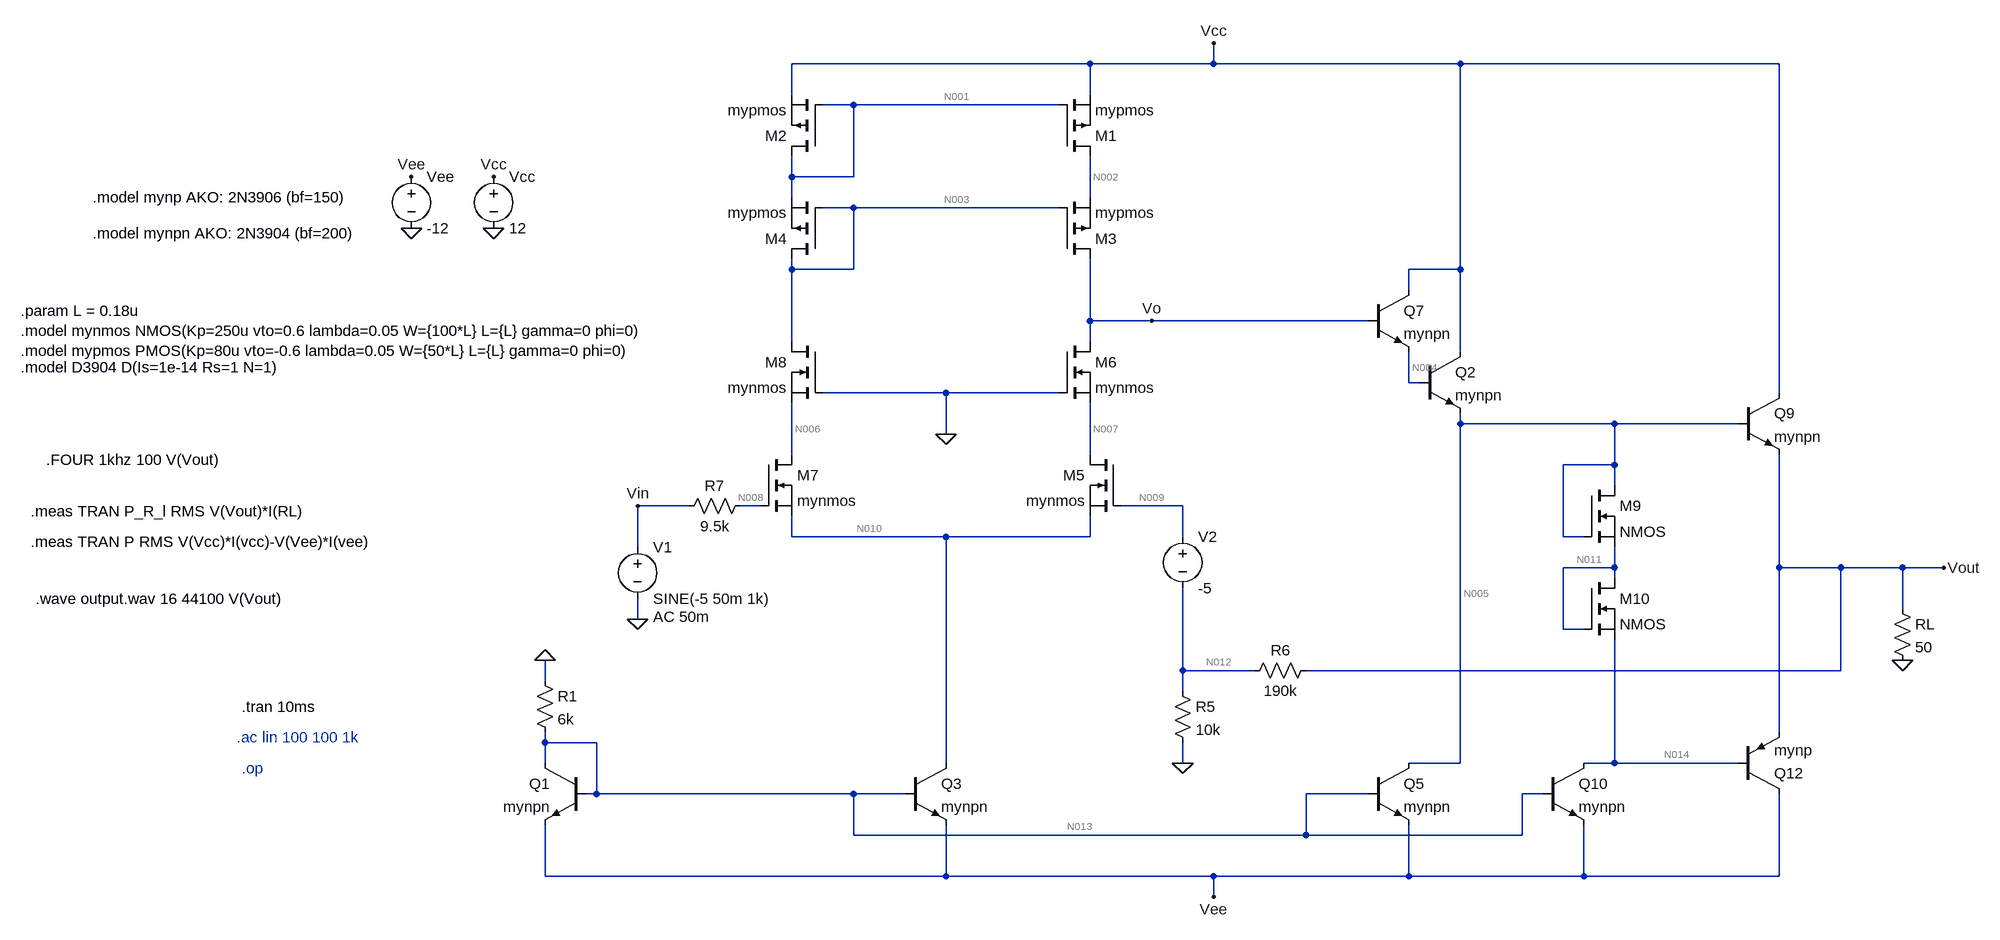
[diagram p0: schematic Ph2_403102322.asc]
Ph2_403102322.asc, the LTspice schematic file:
Version 4.1
SHEET 1 2356 872
WIRE 784 -640 320 -640
WIRE 976 -640 976 -672
WIRE 976 -640 784 -640
WIRE 1360 -640 976 -640
WIRE 1856 -640 1360 -640
WIRE 320 -592 320 -640
WIRE 784 -592 784 -640
WIRE 416 -576 368 -576
WIRE 736 -576 416 -576
WIRE 320 -464 320 -496
WIRE 416 -464 416 -576
WIRE 416 -464 320 -464
WIRE 320 -432 320 -464
WIRE 784 -432 784 -496
WIRE 416 -416 368 -416
WIRE 736 -416 416 -416
WIRE 320 -320 320 -336
WIRE 416 -320 416 -416
WIRE 416 -320 320 -320
WIRE 1360 -320 1360 -640
WIRE 1360 -320 1280 -320
WIRE 1280 -288 1280 -320
WIRE 784 -240 784 -336
WIRE 880 -240 784 -240
WIRE 1216 -240 880 -240
WIRE 320 -208 320 -320
WIRE 784 -208 784 -240
WIRE 1360 -192 1360 -320
WIRE 1280 -144 1280 -192
WIRE 1296 -144 1280 -144
WIRE 560 -128 368 -128
WIRE 736 -128 560 -128
WIRE 1856 -128 1856 -640
WIRE 1360 -80 1360 -96
WIRE 1600 -80 1360 -80
WIRE 1792 -80 1600 -80
WIRE 560 -64 560 -128
WIRE 320 -32 320 -112
WIRE 784 -32 784 -112
WIRE 1600 -16 1600 -80
WIRE 1600 -16 1520 -16
WIRE 1600 16 1600 -16
WIRE 160 48 80 48
WIRE 272 48 240 48
WIRE 928 48 832 48
WIRE 320 96 320 64
WIRE 560 96 320 96
WIRE 784 96 784 64
WIRE 784 96 560 96
WIRE 928 96 928 48
WIRE 1520 96 1520 -16
WIRE 1552 96 1520 96
WIRE 80 112 80 48
WIRE 1600 144 1600 112
WIRE 1600 144 1520 144
WIRE 1856 144 1856 -32
WIRE 1952 144 1856 144
WIRE 2048 144 1952 144
WIRE 2112 144 2048 144
WIRE 1600 160 1600 144
WIRE 2048 208 2048 144
WIRE 80 224 80 192
WIRE 1520 240 1520 144
WIRE 1552 240 1520 240
WIRE 928 304 928 176
WIRE 1040 304 928 304
WIRE 1952 304 1952 144
WIRE 1952 304 1120 304
WIRE -64 320 -64 288
WIRE 928 336 928 304
WIRE 1856 400 1856 144
WIRE -64 416 -64 400
WIRE 16 416 -64 416
WIRE -64 448 -64 416
WIRE 560 448 560 96
WIRE 928 448 928 416
WIRE 1360 448 1360 -80
WIRE 1360 448 1280 448
WIRE 1600 448 1600 256
WIRE 1600 448 1552 448
WIRE 1792 448 1600 448
WIRE 16 496 16 416
WIRE 16 496 0 496
WIRE 416 496 16 496
WIRE 496 496 416 496
WIRE 1216 496 1120 496
WIRE 1488 496 1456 496
WIRE 416 560 416 496
WIRE 1120 560 1120 496
WIRE 1120 560 416 560
WIRE 1456 560 1456 496
WIRE 1456 560 1120 560
WIRE -64 624 -64 544
WIRE 560 624 560 544
WIRE 560 624 -64 624
WIRE 976 624 560 624
WIRE 1280 624 1280 544
WIRE 1280 624 976 624
WIRE 1552 624 1552 544
WIRE 1552 624 1280 624
WIRE 1856 624 1856 496
WIRE 1856 624 1552 624
WIRE 976 656 976 624
FLAG -272 -384 0
FLAG -144 -384 0
FLAG -272 -464 Vee
FLAG -144 -464 Vcc
FLAG 80 224 0
FLAG 880 -240 Vo
FLAG 2048 288 0
FLAG 2112 144 Vout
FLAG 928 448 0
FLAG 560 -64 0
FLAG 80 48 Vin
FLAG -64 288 0
FLAG 976 -672 Vcc
FLAG 976 656 Vee
SYMBOL res -80 304 R0
SYMATTR InstName R1
SYMATTR Value 6k
SYMBOL npn 0 448 M0
SYMATTR InstName Q1
SYMATTR Value mynpn
SYMBOL npn 496 448 R0
SYMATTR InstName Q3
SYMATTR Value mynpn
SYMBOL voltage -272 -480 R0
SYMATTR InstName Vee
SYMATTR Value -12
SYMBOL voltage -144 -480 R0
WINDOW 123 0 0 Left 0
WINDOW 39 0 0 Left 0
SYMATTR InstName Vcc
SYMATTR Value 12
SYMBOL voltage 80 96 R0
WINDOW 123 24 124 Left 2
WINDOW 39 0 0 Left 0
SYMATTR Value2 AC 50m
SYMATTR InstName V1
SYMATTR Value SINE(-5 50m 1k)
SYMBOL npn 1216 448 R0
SYMATTR InstName Q5
SYMATTR Value mynpn
SYMBOL npn 1216 -288 R0
SYMATTR InstName Q7
SYMATTR Value mynpn
SYMBOL pmos 736 -496 M180
SYMATTR InstName M1
SYMATTR Value mypmos
SYMBOL pmos 368 -496 R180
SYMATTR InstName M2
SYMATTR Value mypmos
SYMBOL nmos 832 -32 M0
SYMATTR InstName M5
SYMATTR Value mynmos
SYMBOL nmos 272 -32 R0
SYMATTR InstName M7
SYMATTR Value mynmos
SYMBOL nmos 736 -208 R0
SYMATTR InstName M6
SYMATTR Value mynmos
SYMBOL nmos 368 -208 M0
SYMATTR InstName M8
SYMATTR Value mynmos
SYMBOL pmos 736 -336 M180
SYMATTR InstName M3
SYMATTR Value mypmos
SYMBOL pmos 368 -336 R180
SYMATTR InstName M4
SYMATTR Value mypmos
SYMBOL res 2032 192 R0
SYMATTR InstName RL
SYMATTR Value 50
SYMBOL npn 1488 448 R0
SYMATTR InstName Q10
SYMATTR Value mynpn
SYMBOL npn 1792 -128 R0
SYMATTR InstName Q9
SYMATTR Value mynpn
SYMBOL pnp 1792 496 M180
SYMATTR InstName Q12
SYMATTR Value mynp
SYMBOL res 912 320 R0
SYMATTR InstName R5
SYMATTR Value 10k
SYMBOL res 1136 288 R90
WINDOW 0 0 56 VBottom 2
WINDOW 3 32 56 VTop 2
SYMATTR InstName R6
SYMATTR Value 190k
SYMBOL res 256 32 R90
WINDOW 0 0 56 VBottom 2
WINDOW 3 32 56 VTop 2
SYMATTR InstName R7
SYMATTR Value 9.5k
SYMBOL voltage 928 80 R0
WINDOW 123 0 0 Left 0
WINDOW 39 0 0 Left 0
SYMATTR InstName V2
SYMATTR Value -5
SYMBOL npn 1296 -192 R0
SYMATTR InstName Q2
SYMATTR Value mynpn
SYMBOL nmos 1552 16 R0
SYMATTR InstName M9
SYMBOL nmos 1552 160 R0
SYMATTR InstName M10
TEXT -768 -432 Left 2 !.model mynp AKO: 2N3906 (bf=150)
TEXT -768 -376 Left 2 !.model mynpn AKO: 2N3904 (bf=200)
TEXT -880 -256 Left 2 !.param L = 0.18u\n.model mynmos NMOS(Kp=250u vto=0.6 lambda=0.05 W={100*L} L={L} gamma=0 phi=0)\n.model mypmos PMOS(Kp=80u vto=-0.6 lambda=0.05 W={50*L} L={L} gamma=0 phi=0)
TEXT -536 456 Left 2 ;.op
TEXT -544 408 Left 2 ;.ac lin 100 100 1k
TEXT -536 360 Left 2 !.tran 10ms
TEXT -880 -168 Left 2 !.model D3904 D(Is=1e-14 Rs=1 N=1)
TEXT -840 -24 Left 2 !.FOUR 1khz 100 V(Vout)
TEXT -864 56 Left 2 !.meas TRAN P_R_l RMS V(Vout)*I(RL)
TEXT -864 104 Left 2 !.meas TRAN P RMS V(Vcc)*I(vcc)-V(Vee)*I(vee)
TEXT -856 192 Left 2 !.wave output.wav 16 44100 V(Vout)

The netlist it stands for:
* Ph2_403102322.asc
R1 0 N013 6k
Q1 N013 N013 Vee 0 mynpn
Q3 N010 N013 Vee 0 mynpn
Vee Vee 0 -12
Vcc Vcc 0 12
V1 Vin 0 SINE(-5 50m 1k) AC 50m
Q5 N005 N013 Vee 0 mynpn
Q7 Vcc Vo N004 0 mynpn
M1 N002 N001 Vcc Vcc mypmos
M2 N001 N001 Vcc Vcc mypmos
M5 N007 N009 N010 N010 mynmos
M7 N006 N008 N010 N010 mynmos
M6 Vo 0 N007 N007 mynmos
M8 N003 0 N006 N006 mynmos
M3 Vo N003 N002 N002 mypmos
M4 N003 N003 N001 N001 mypmos
RL Vout 0 50
Q10 N014 N013 Vee 0 mynpn
Q9 Vcc N005 Vout 0 mynpn
Q12 Vee N014 Vout 0 mynp
R5 N012 0 10k
R6 Vout N012 190k
R7 N008 Vin 9.5k
V2 N009 N012 -5
Q2 Vcc N004 N005 0 mynpn
M9 N005 N005 N011 N011 NMOS
M10 N011 N011 N014 N014 NMOS
.model NPN NPN
.model PNP PNP
.lib standard.bjt
.model NMOS NMOS
.model PMOS PMOS
.lib standard.mos
.model mynp AKO: 2N3906 (bf=150)
.model mynpn AKO: 2N3904 (bf=200)
.param L = 0.18u
.model mynmos NMOS(Kp=250u vto=0.6 lambda=0.05 W={100*L} L={L} gamma=0 phi=0)
.model mypmos PMOS(Kp=80u vto=-0.6 lambda=0.05 W={50*L} L={L} gamma=0 phi=0)
* .op
* .ac lin 100 100 1k
.tran 10ms
.model D3904 D(Is=1e-14 Rs=1 N=1)
.FOUR 1khz 100 V(Vout)
.meas TRAN P_R_l RMS V(Vout)*I(RL)
.meas TRAN P RMS V(Vcc)*I(vcc)-V(Vee)*I(vee)
.wave output.wav 16 44100 V(Vout)
.backanno
.end

* Results of the author's LTspice run, read from the files saved beside the schematic
* Operating Point, zero values left out:
*   V(vee) = -12 V
*   V(vcc) = 12 V
*   V(vin) = -5 V
*   V(vo) = 2.103 V
*   V(n001) = 10.72 V
*   V(n009) = -4.999 V
*   V(n006) = -826.9 mV
*   V(n003) = 9.447 V
*   V(n012) = 694.6 µV
*   V(n013) = -11.33 V
*   V(n010) = -5.85 V
*   V(n005) = 870.6 mV
*   V(n004) = 1.557 V
*   V(n002) = 10.63 V
*   V(n007) = -861 mV
*   V(n008) = -5 V
*   V(vout) = 13.89 mV
*   V(n014) = -852.7 mV
*   V(n011) = 8.956 mV
*   I(Vcc) = -231.7 mA
*   Ic(Q7) = 16.36 µA
*   Ib(Q7) = 74.42 nA
*   Ie(Q7) = -16.43 µA
*   Id(M5) = 977.8 µA
*   Is(M5) = -977.8 µA
*   Ib(M5) = -4.999 pA
*   Id(M6) = 977.8 µA
*   Is(M6) = -977.8 µA
*   Ib(M6) = -2.974 pA
*   Id(M4) = -973.7 µA
*   Is(M4) = 973.7 µA
*   Ib(M4) = 1.287 pA
*   Ic(Q9) = 226.1 mA
*   Ib(Q9) = 1.534 mA
*   Ie(Q9) = -227.6 mA
*   I(R5) = 69.46 nA
*   I(R1) = 1.888 mA
*   Ic(Q3) = 1.952 mA
*   Ib(Q3) = 9.294 µA
*   Ie(Q3) = -1.961 mA
*   Id(M8) = 973.7 µA
*   Is(M8) = -973.7 µA
*   Ib(M8) = -10.28 pA
*   Id(M9) = 7.424 µA
*   Is(M9) = -7.424 µA
*   Id(M10) = 7.424 µA
*   Is(M10) = -7.424 µA
*   Ic(Q1) = 1.851 mA
*   Ib(Q1) = 9.297 µA
*   Ie(Q1) = -1.86 mA
*   Ic(Q5) = 2.075 mA
*   Ib(Q5) = 9.289 µA
*   Ie(Q5) = -2.084 mA
*   Id(M1) = -977.9 µA
*   Is(M1) = 977.9 µA
*   Ib(M1) = 1.378 pA
*   Id(M7) = 973.7 µA
*   Is(M7) = -973.7 µA
*   Ib(M7) = -5.033 pA
*   I(RL) = 277.8 µA
*   Ic(Q10) = 2.043 mA
*   Ib(Q10) = 9.29 µA
*   Ie(Q10) = -2.053 mA
*   Ic(Q12) = -225.3 mA
*   Ib(Q12) = -2.036 mA
*   Ie(Q12) = 227.3 mA
*   I(Vee) = 233.3 mA
*   Id(M2) = -973.7 µA
*   Is(M2) = 973.7 µA
*   Ib(M2) = 1.287 pA
*   Id(M3) = -977.9 µA
*   Is(M3) = 977.9 µA
*   Ib(M3) = 8.539 pA
*   I(R6) = 69.46 nA
*   Ic(Q2) = 3.6 mA
*   Ib(Q2) = 16.43 µA
*   Ie(Q2) = -3.617 mA
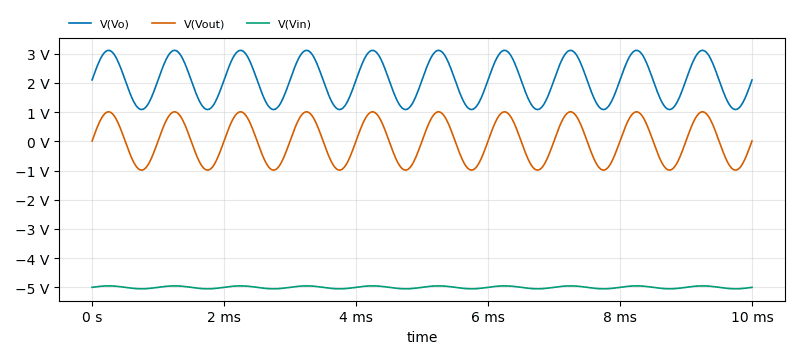
[diagram p1: Transient Analysis of Ph2_403102322.asc, plotted from the saved traces]
* Transient Analysis, 1 run:
*   V(Vo): min 1.09 V, max 3.117 V, average 2.103 V, rms 2.222 V, last 2.103 V
*   V(Vout): min -984.4 mV, max 1.012 V, average 13.89 mV, rms 706.2 mV, last 13.86 mV
*   V(Vin): min -5.05 V, max -4.95 V, average -5 V, rms 5 V, last -5 V
* From the log:
*   P_R_l: RMS(V(Vout)*I(RL))=0.0122060317851 FROM 0 TO 0.01
*   P: RMS(V(Vcc)*I(vcc)-V(Vee)*I(vee))=0.170489128881 FROM 0 TO 0.01
*   Fourier components of V(Vout)
*   N-Period=1
*   DC component:0.0138875
*   Harmonic  Frequency   Fourier   Normalized   Phase    Normalized
*    Number     [Hz]     Component   Component  [degree]  Phase [deg]
*       1      1.000e+03   9.979e-01   1.000e+00     90.00°      0.00°
*       2      2.000e+03   1.351e-05   1.354e-05     16.55°    -73.45°
*       3      3.000e+03   1.218e-04   1.220e-04    -89.79°   -179.79°
*       4      4.000e+03   6.304e-06   6.318e-06    128.68°     38.68°
*       5      5.000e+03   1.260e-04   1.263e-04    -93.18°   -183.19°
*       6      6.000e+03   9.126e-06   9.145e-06    171.82°     81.82°
*       7      7.000e+03   6.895e-05   6.910e-05    -96.79°   -186.80°
*       8      8.000e+03   6.886e-06   6.900e-06   -150.05°   -240.05°
*       9      9.000e+03   5.786e-06   5.798e-06    109.51°     19.51°
*      10      1.000e+04   5.723e-06   5.736e-06    -64.23°   -154.23°
*      11      1.100e+04   4.821e-05   4.832e-05     82.86°     -7.14°
*      12      1.200e+04   8.828e-06   8.846e-06    -14.52°   -104.52°
*      13      1.300e+04   4.112e-05   4.120e-05     78.37°    -11.64°
*      14      1.400e+04   7.186e-06   7.201e-06     24.57°    -65.43°
*      15      1.500e+04   3.544e-06   3.551e-06     39.57°    -50.43°
*      16      1.600e+04   6.269e-06   6.282e-06    107.21°     17.21°
*      17      1.700e+04   2.974e-05   2.980e-05   -101.08°   -191.08°
*      18      1.800e+04   9.845e-06   9.865e-06    155.72°     65.72°
*      19      1.900e+04   3.139e-05   3.146e-05   -107.23°   -197.24°
*      20      2.000e+04   8.291e-06   8.308e-06   -170.60°   -260.60°
*      21      2.100e+04   6.960e-06   6.974e-06   -131.04°   -221.05°
*      22      2.200e+04   5.569e-06   5.581e-06    -89.73°   -179.73°
*      23      2.300e+04   2.023e-05   2.027e-05     77.55°    -12.45°
*      24      2.400e+04   9.455e-06   9.475e-06    -29.39°   -119.39°
*      25      2.500e+04   2.507e-05   2.512e-05     68.18°    -21.82°
*      26      2.600e+04   8.817e-06   8.836e-06      7.19°    -82.81°
*      27      2.700e+04   7.294e-06   7.310e-06     41.72°    -48.28°
*      28      2.800e+04   7.057e-06   7.072e-06     85.20°     -4.80°
*      29      2.900e+04   1.740e-05   1.744e-05   -104.06°   -194.06°
*      30      3.000e+04   1.210e-05   1.212e-05    139.52°     49.52°
*      31      3.100e+04   2.483e-05   2.488e-05   -116.66°   -206.66°
*      32      3.200e+04   1.188e-05   1.191e-05    168.96°     78.96°
*      33      3.300e+04   1.148e-05   1.151e-05   -138.97°   -228.97°
*      34      3.400e+04   6.617e-06   6.631e-06   -125.85°   -215.85°
*      35      3.500e+04   1.259e-05   1.262e-05     82.07°     -7.94°
*      36      3.600e+04   1.131e-05   1.133e-05    -46.05°   -136.05°
*      37      3.700e+04   2.195e-05   2.199e-05     59.34°    -30.66°
*      38      3.800e+04   1.304e-05   1.307e-05     -9.56°    -99.56°
*      39      3.900e+04   1.165e-05   1.167e-05     25.67°    -64.33°
*      40      4.000e+04   1.087e-05   1.089e-05     62.74°    -27.26°
*      41      4.100e+04   1.796e-05   1.800e-05    -96.55°   -186.56°
*      42      4.200e+04   2.241e-05   2.246e-05    122.05°     32.05°
*      43      4.300e+04   3.581e-05   3.588e-05   -121.43°   -211.43°
*      44      4.400e+04   3.173e-05   3.180e-05    145.63°     55.63°
*      45      4.500e+04   3.511e-05   3.518e-05   -141.83°   -231.83°
*      46      4.600e+04   2.764e-05   2.770e-05    169.76°     79.76°
*      47      4.700e+04   2.209e-05   2.214e-05    171.01°     81.01°
*      48      4.800e+04   1.874e-05   1.878e-05   -134.22°   -224.22°
*      49      4.900e+04   2.809e-05   2.815e-05     98.48°      8.48°
*      50      5.000e+04   2.781e-05   2.787e-05    -73.37°   -163.37°
*      51      5.100e+04   3.878e-05   3.886e-05     67.30°    -22.70°
*      52      5.200e+04   3.610e-05   3.617e-05    -49.20°   -139.20°
*      53      5.300e+04   3.511e-05   3.518e-05     44.85°    -45.15°
*      54      5.400e+04   3.057e-05   3.063e-05    -31.63°   -121.63°
*      55      5.500e+04   2.223e-05   2.228e-05     11.73°    -78.27°
*      56      5.600e+04   1.640e-05   1.643e-05     -0.82°    -90.82°
*      57      5.700e+04   1.486e-05   1.489e-05    -47.53°   -137.53°
*      58      5.800e+04   1.126e-05   1.128e-05     76.07°    -13.93°
*      59      5.900e+04   1.425e-05   1.428e-05    -97.39°   -187.39°
*      60      6.000e+04   1.426e-05   1.429e-05    117.30°     27.30°
*      61      6.100e+04   1.055e-05   1.057e-05   -134.83°   -224.83°
*      62      6.200e+04   1.039e-05   1.042e-05    138.86°     48.86°
*      63      6.300e+04   6.047e-06   6.060e-06    172.22°     82.22°
*      64      6.400e+04   3.602e-06   3.610e-06   -170.02°   -260.02°
*      65      6.500e+04   4.432e-06   4.441e-06    106.24°     16.24°
*      66      6.600e+04   4.600e-06   4.610e-06    -74.16°   -164.16°
*      67      6.700e+04   3.175e-06   3.181e-06     43.21°    -46.79°
*      68      6.800e+04   4.477e-06   4.487e-06    -47.09°   -137.09°
*      69      6.900e+04   3.082e-06   3.089e-06    -30.66°   -120.66°
*      70      7.000e+04   1.746e-06   1.750e-06      9.23°    -80.77°
*      71      7.100e+04   3.174e-06   3.181e-06    -75.84°   -165.84°
*      72      7.200e+04   2.799e-06   2.805e-06    100.69°     10.68°
*      73      7.300e+04   1.902e-06   1.906e-06   -123.71°   -213.71°
*      74      7.400e+04   2.956e-06   2.963e-06    122.49°     32.49°
*      75      7.500e+04   1.662e-06   1.665e-06    150.22°     60.22°
*      76      7.600e+04   1.147e-06   1.150e-06    156.59°     66.59°
*      77      7.700e+04   1.905e-06   1.909e-06    108.03°     18.03°
*      78      7.800e+04   1.275e-06   1.278e-06    -85.29°   -175.29°
*      79      7.900e+04   9.943e-07   9.964e-07     65.92°    -24.08°
*      80      8.000e+04   1.599e-06   1.602e-06    -61.80°   -151.80°
*      81      8.100e+04   9.216e-07   9.236e-07    -37.58°   -127.58°
*      82      8.200e+04   6.498e-07   6.511e-07    -26.65°   -116.65°
*      83      8.300e+04   1.180e-06   1.183e-06    -70.61°   -160.61°
*      84      8.400e+04   8.439e-07   8.457e-07     87.25°     -2.75°
*      85      8.500e+04   4.621e-07   4.631e-07   -100.75°   -190.75°
*      86      8.600e+04   1.150e-06   1.153e-06    104.47°     14.47°
*      87      8.700e+04   6.358e-07   6.371e-07    115.92°     25.92°
*      88      8.800e+04   6.628e-07   6.642e-07    110.31°     20.31°
*      89      8.900e+04   1.061e-06   1.063e-06     98.79°      8.79°
*      90      9.000e+04   8.667e-08   8.685e-08     94.42°      4.42°
*      91      9.100e+04   8.433e-07   8.451e-07     88.26°     -1.74°
*      92      9.200e+04   1.396e-07   1.399e-07     33.95°    -56.06°
*      93      9.300e+04   5.412e-07   5.424e-07     79.86°    -10.14°
*      94      9.400e+04   6.435e-07   6.449e-07     83.59°     -6.41°
*      95      9.500e+04   7.602e-07   7.618e-07     87.41°     -2.59°
*      96      9.600e+04   1.599e-06   1.603e-06     91.68°      1.68°
*      97      9.700e+04   1.944e-06   1.948e-06     92.64°      2.63°
*      98      9.800e+04   3.486e-06   3.494e-06     93.28°      3.28°
*      99      9.900e+04   5.718e-06   5.730e-06     93.50°      3.50°
*     100      1.000e+05   1.269e-05   1.272e-05     93.69°      3.69°
*   Partial Harmonic Distortion: 0.024688%
*   Total Harmonic Distortion:   0.028397%